# Altium schematic sheet Sheet1.SchDoc
size A; SheetNumber: 1; SheetTotal: 1
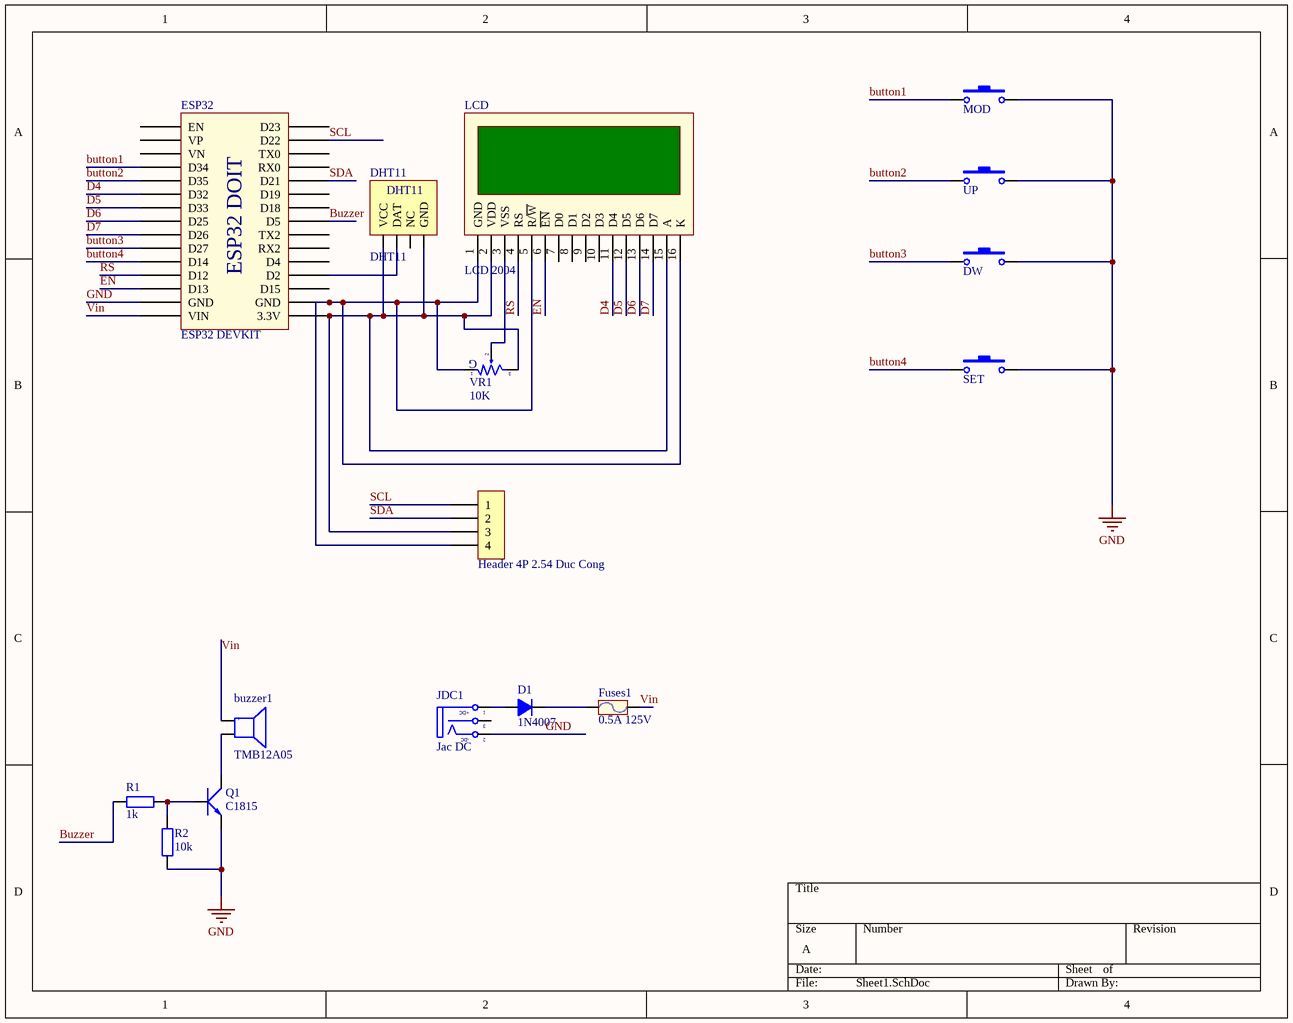
[diagram p0: Sheet1.SchDoc]

## Parts
buzzer1  TMB12A05  [Speaker]
D1  1N4007  [D1A]
DHT11  DHT11  [DHT11]
DW  Nut Nhan 2 Chan SMD 3x6x2.5  [Button 2 Pin]  (value not drawn)
ESP32  ESP32 DEVKIT  [ESP32 WROOM 32 KIT]
Fuses1  0.5A 125V  [Cau Chi SMD1808]
H?  Header 4P 2.54 Duc Cong  [Header 4P DC 2.54]
JDC1  Jac DC  [DC-IN]
LCD  LCD 2004  [LCD 2004]
MOD  Nut Nhan 2 Chan SMD 3x6x2.5  [Button 2 Pin]  (value not drawn)
Q1  C1815  [TO92]
R1  1k  [RES-1/4W]
R2  10k  [RES-1/4W]
SET  Nut Nhan 2 Chan SMD 3x6x2.5  [Button 2 Pin]  (value not drawn)
UP  Nut Nhan 2 Chan SMD 3x6x2.5  [Button 2 Pin]  (value not drawn)
VR1  10K  [VR-S2]

## Nets
GND: DW.2 ESP32.14(GND) JDC1.2(TN) MOD.2 Q1.1(E) R2.1 SET.2 UP.2
button1: ESP32.4(D34) MOD.1
button2: ESP32.5(D35) UP.1
button3: DW.1 ESP32.10(D27)
button4: ESP32.11(D14) SET.1
Buzzer: ESP32.23(D5) R1.1
D4: ESP32.6(D32) LCD.11(D4)
D5: ESP32.7(D33) LCD.12(D5)
D6: ESP32.8(D25) LCD.13(D6)
D7: ESP32.9(D26) LCD.14(D7)
EN: ESP32.13(D13) LCD.6(~{EN})
RS: ESP32.12(D12) LCD.4(RS)
SCL: ESP32.29(D22) H?.1
SDA: ESP32.26(D21) H?.2
Vin: buzzer1.1(+) ESP32.15(VIN) Fuses1.2
Netbuzzer1_2: buzzer1.2(-) Q1.2(C)
NetD1_1: D1.1(A) JDC1.1(T)
NetD1_2: D1.2(K) Fuses1.1
NetDHT11_1: DHT11.1(VCC) DHT11.4(GND) ESP32.16(3.3V) H?.3 LCD.2(VDD) LCD.15(A) VR1.3
NetDHT11_2: DHT11.2(DAT) ESP32.19(D2)
NetESP32_17: ESP32.17(GND) H?.4 LCD.1(GND) LCD.5(R/~{W}) LCD.16(K) VR1.1
NetLCD_3: LCD.3(VSS) VR1.2
NetQ1_3: Q1.3(B) R1.2 R2.2

Not connected (* = marked no-connect by the designer): DHT11 3(NC); ESP32 1(EN) 2(VP) 3(VN) 18(D15) 20(D4) 21(RX2) 22(TX2) 24(D18) 25(D19) 27(RX0) 28(TX0) 30(D23); JDC1 3(S); LCD 7(D0) 8(D1) 9(D2) 10(D3)

## Notes on the sheet
- (in symbol DCIN) +DC; -DC
- (in symbol ESP32 WROOM 32 KIT) ESP32 DOIT
- (in symbol VR-S) G

## Library data of the parts
buzzer1 = Buzz: Buzzer >= 80dB, 5V
D1 = D1A: Diode 1A; Value: 1N4007
DHT11 = DHT11: Manufacturer: W¨¹rth Elektronik eiSos GmbH; partNo: 613004143121; ComponentLink1 Description: Manufacturer; ComponentLink2 Description: Datasheet; NoPins: 04; Created Date: 29 March 2013; ComponentLink1URL: http://www.we-online.com; ComponentLink2URL: http://katalog.we-online.de/em/datasheet/6130xx143121.pdf; Created by: Karrer Zheng
DW MOD SET UP = Nut Nhan 2 Chan SMD 3x6x2.5: Ma_Hang: MH001036; Ten: Nút Nhấn 2 Chân 3x6x2.5MM SMD
ESP32 = ESP32 WROOM 32 KIT
Fuses1 = Cau chi 0.5A 125V SMD1808: Ma_Hang: MH009241; Ten: Cầu Chì 0.5A 125V SMD1808 0451.500MRL
H? = Header 4P 2.54 Duc Cong: Cắm; Ten_Linh_Kien: Header 4P XH2.54-4P Đực Cong; Don_Vi: Con; Ma_Hang: MH001310; Chung_Loai: Cắm
JDC1 = DCIN: Jac DC input; Value: Jac DC
LCD = LCD 2004 5V: LCD 2004 5V Xanh Dương; Ten: LCD 2004 Xanh Dương; Ma_Hang: WVEZ; CHIP: HD44780; Don Vi Mua: Nshop
Q1 = Trans C1815 DIP: NPN transistor; Value: C9014
R1 = Tro 0603 1% 1k: Dán; So_Chan: 2; Don_Vi: Con; Ten_Linh_Kien: Trở 0603 1% 1k; Ma_Hang: MH006334; Chung_Loai: Dán; Kieu_Chan: *
R2 = Tro 0603 5% 10k: Dán; Don_Vi: Con; So_Chan: 2; Ten_Linh_Kien: Trở 0603 5% 10k; Ma_Hang: MH006316; Chung_Loai: Dán; Kieu_Chan: *
VR1 = VR-S: Var Resistor; Value: Volume 50k